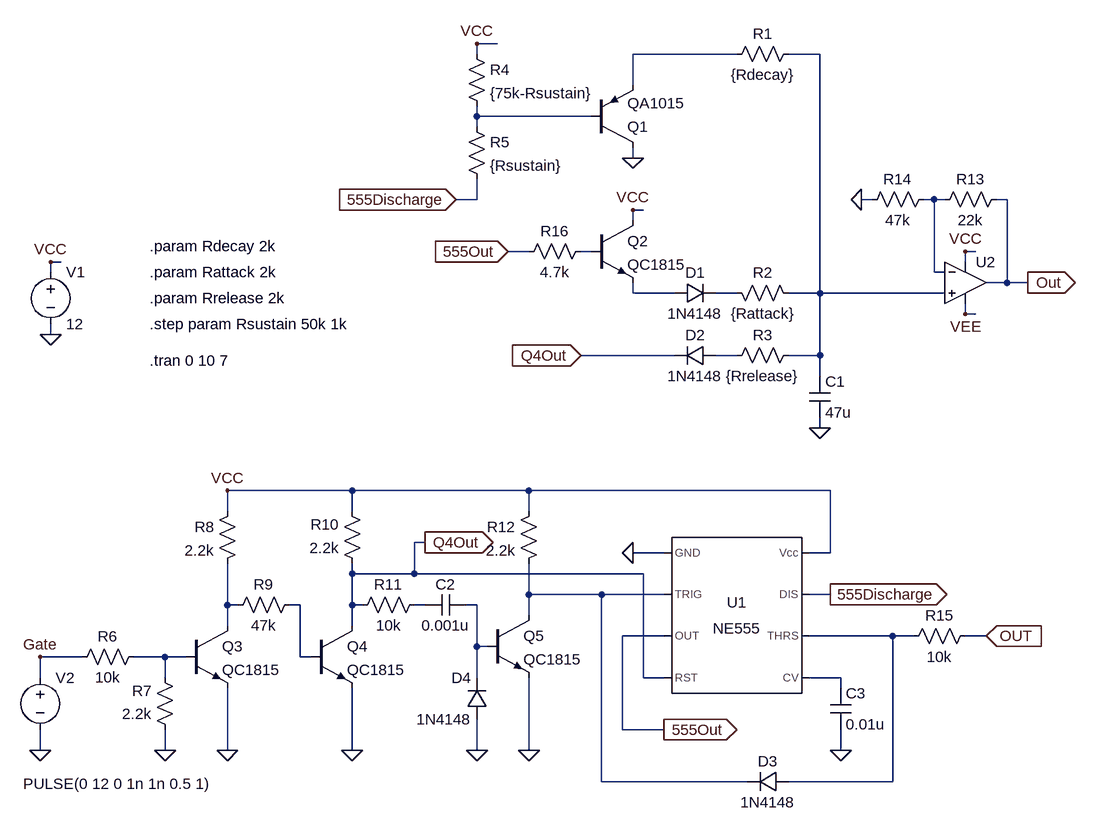
[diagram p0: schematic EG_Analog2_0.asc]
EG_Analog2_0.asc, the LTspice schematic file:
Version 4
SHEET 1 1740 1424
WIRE 704 240 672 240
WIRE 672 256 672 240
WIRE 1072 256 912 256
WIRE 1200 256 1152 256
WIRE 912 304 912 256
WIRE 672 352 672 336
WIRE 848 352 672 352
WIRE 672 368 672 352
WIRE 912 416 912 400
WIRE 672 480 672 448
WIRE 672 480 640 480
WIRE 1280 480 1264 480
WIRE 1376 480 1360 480
WIRE 1392 480 1376 480
WIRE 1488 480 1472 480
WIRE 928 496 912 496
WIRE 912 512 912 496
WIRE 752 560 720 560
WIRE 848 560 832 560
WIRE 1440 560 1424 560
WIRE 32 576 16 576
WIRE 1424 576 1424 560
WIRE 16 592 16 576
WIRE 1376 592 1376 480
WIRE 1392 592 1376 592
WIRE 1488 608 1488 480
WIRE 1488 608 1456 608
WIRE 1520 608 1488 608
WIRE 912 624 912 608
WIRE 976 624 912 624
WIRE 1072 624 1040 624
WIRE 1200 624 1200 256
WIRE 1200 624 1152 624
WIRE 1392 624 1200 624
WIRE 1424 656 1424 640
WIRE 1440 656 1424 656
WIRE 16 688 16 672
WIRE 976 720 832 720
WIRE 1072 720 1040 720
WIRE 1200 720 1200 624
WIRE 1200 720 1152 720
WIRE 1200 752 1200 720
WIRE 1200 832 1200 816
WIRE 480 928 288 928
WIRE 752 928 480 928
WIRE 1216 928 752 928
WIRE 288 960 288 928
WIRE 480 960 480 928
WIRE 752 960 752 928
WIRE 592 1008 576 1008
WIRE 960 1024 912 1024
WIRE 1216 1024 1216 928
WIRE 1216 1024 1184 1024
WIRE 480 1056 480 1040
WIRE 576 1056 576 1008
WIRE 576 1056 480 1056
WIRE 928 1056 576 1056
WIRE 752 1088 752 1040
WIRE 864 1088 752 1088
WIRE 960 1088 864 1088
WIRE 1216 1088 1184 1088
WIRE 288 1104 288 1040
WIRE 304 1104 288 1104
WIRE 400 1104 384 1104
WIRE 480 1104 480 1056
WIRE 496 1104 480 1104
WIRE 592 1104 576 1104
WIRE 672 1104 656 1104
WIRE 752 1120 752 1088
WIRE 288 1136 288 1104
WIRE 480 1136 480 1104
WIRE 960 1152 896 1152
WIRE 1312 1152 1184 1152
WIRE 1344 1152 1312 1152
WIRE 1456 1152 1424 1152
WIRE 672 1168 672 1104
WIRE 688 1168 672 1168
WIRE 64 1184 0 1184
WIRE 192 1184 144 1184
WIRE 224 1184 192 1184
WIRE 400 1184 400 1104
WIRE 416 1184 400 1184
WIRE 0 1216 0 1184
WIRE 192 1216 192 1184
WIRE 672 1216 672 1168
WIRE 928 1216 928 1056
WIRE 960 1216 928 1216
WIRE 1232 1216 1184 1216
WIRE 1232 1232 1232 1216
WIRE 896 1296 896 1152
WIRE 960 1296 896 1296
WIRE 0 1328 0 1296
WIRE 192 1328 192 1296
WIRE 288 1328 288 1232
WIRE 480 1328 480 1232
WIRE 672 1328 672 1280
WIRE 752 1328 752 1216
WIRE 1232 1328 1232 1296
WIRE 864 1376 864 1088
WIRE 1088 1376 864 1376
WIRE 1312 1376 1312 1152
WIRE 1312 1376 1152 1376
FLAG 640 480 555Discharge
IOPIN 640 480 In
FLAG 912 416 0
FLAG 720 560 555Out
IOPIN 720 560 In
FLAG 832 720 Q4Out
IOPIN 832 720 In
FLAG 1200 832 0
FLAG 912 496 VCC
FLAG 1520 608 Out
IOPIN 1520 608 Out
FLAG 16 688 0
FLAG 16 576 VCC
FLAG 672 240 VCC
FLAG 0 1328 0
FLAG 192 1328 0
FLAG 288 1328 0
FLAG 480 1328 0
FLAG 752 1328 0
FLAG 592 1008 Q4Out
IOPIN 592 1008 Out
FLAG 912 1024 0
FLAG 960 1296 555Out
IOPIN 960 1296 Out
FLAG 1216 1088 555Discharge
IOPIN 1216 1088 Out
FLAG 1456 1152 OUT
IOPIN 1456 1152 In
FLAG 1232 1328 0
FLAG 288 928 VCC
FLAG 0 1184 Gate
FLAG 1264 480 0
FLAG 1424 560 VCC
FLAG 1424 656 VEE
FLAG 672 1328 0
SYMBOL pnp 848 400 M180
SYMATTR InstName Q1
SYMATTR Value QA1015
SYMBOL res 1168 240 R90
WINDOW 0 0 56 VBottom 2
WINDOW 3 32 56 VTop 2
SYMATTR InstName R1
SYMATTR Value {Rdecay}
SYMBOL npn 848 512 R0
SYMATTR InstName Q2
SYMATTR Value QC1815
SYMBOL diode 976 640 R270
WINDOW 0 32 32 VTop 2
WINDOW 3 0 32 VBottom 2
SYMATTR InstName D1
SYMATTR Value 1N4148
SYMBOL res 1056 608 M90
WINDOW 0 0 56 VBottom 2
WINDOW 3 32 56 VTop 2
SYMATTR InstName R2
SYMATTR Value {Rattack}
SYMBOL diode 1040 704 R90
WINDOW 0 0 32 VBottom 2
WINDOW 3 32 32 VTop 2
SYMATTR InstName D2
SYMATTR Value 1N4148
SYMBOL res 1168 704 R90
WINDOW 0 0 56 VBottom 2
WINDOW 3 32 56 VTop 2
SYMATTR InstName R3
SYMATTR Value {Rrelease}
SYMBOL cap 1184 752 R0
SYMATTR InstName C1
SYMATTR Value 47u
SYMBOL voltage 16 576 R0
WINDOW 123 0 0 Left 2
WINDOW 39 0 0 Left 2
SYMATTR InstName V1
SYMATTR Value 12
SYMBOL res 656 240 R0
SYMATTR InstName R4
SYMATTR Value {75k-Rsustain}
SYMBOL res 656 352 R0
SYMATTR InstName R5
SYMATTR Value {Rsustain}
SYMBOL voltage 0 1200 R0
WINDOW 3 -26 179 Left 2
WINDOW 123 0 0 Left 2
WINDOW 39 0 0 Left 2
SYMATTR Value PULSE(0 12 0 1n 1n 0.5 1)
SYMATTR InstName V2
SYMBOL res 160 1168 R90
WINDOW 0 0 56 VBottom 2
WINDOW 3 32 56 VTop 2
SYMATTR InstName R6
SYMATTR Value 10k
SYMBOL res 208 1312 R180
WINDOW 0 36 76 Left 2
WINDOW 3 36 40 Left 2
SYMATTR InstName R7
SYMATTR Value 2.2k
SYMBOL npn 224 1136 R0
SYMATTR InstName Q3
SYMATTR Value QC1815
SYMBOL res 304 944 M0
SYMATTR InstName R8
SYMATTR Value 2.2k
SYMBOL res 400 1088 R90
WINDOW 0 0 56 VBottom 2
WINDOW 3 32 56 VTop 2
SYMATTR InstName R9
SYMATTR Value 47k
SYMBOL npn 416 1136 R0
SYMATTR InstName Q4
SYMATTR Value QC1815
SYMBOL cap 656 1088 R90
WINDOW 0 0 32 VBottom 2
WINDOW 3 32 32 VTop 2
SYMATTR InstName C2
SYMATTR Value 0.001u
SYMBOL npn 688 1120 R0
SYMATTR InstName Q5
SYMATTR Value QC1815
SYMBOL res 496 1056 R180
WINDOW 0 36 76 Left 2
WINDOW 3 36 40 Left 2
SYMATTR InstName R10
SYMATTR Value 2.2k
SYMBOL res 592 1088 R90
WINDOW 0 0 56 VBottom 2
WINDOW 3 32 56 VTop 2
SYMATTR InstName R11
SYMATTR Value 10k
SYMBOL res 768 944 M0
SYMATTR InstName R12
SYMATTR Value 2.2k
SYMBOL Misc\\NE555 1072 1120 R0
SYMATTR InstName U1
SYMBOL cap 1216 1232 R0
SYMATTR InstName C3
SYMATTR Value 0.01u
SYMBOL diode 1152 1360 R90
WINDOW 0 0 32 VBottom 2
WINDOW 3 32 32 VTop 2
SYMATTR InstName D3
SYMATTR Value 1N4148
SYMBOL Opamps\\UniversalOpamp2 1424 608 R0
SYMATTR InstName U2
SYMBOL res 1488 464 R90
WINDOW 0 0 56 VBottom 2
WINDOW 3 32 56 VTop 2
SYMATTR InstName R13
SYMATTR Value 22k
SYMBOL res 1376 464 R90
WINDOW 0 0 56 VBottom 2
WINDOW 3 32 56 VTop 2
SYMATTR InstName R14
SYMATTR Value 47k
SYMBOL res 1440 1136 R90
WINDOW 0 0 56 VBottom 2
WINDOW 3 32 56 VTop 2
SYMATTR InstName R15
SYMATTR Value 10k
SYMBOL res 848 544 R90
WINDOW 0 0 56 VBottom 2
WINDOW 3 32 56 VTop 2
SYMATTR InstName R16
SYMATTR Value 4.7k
SYMBOL diode 688 1280 R180
WINDOW 0 24 64 Left 2
WINDOW 3 24 0 Left 2
SYMATTR InstName D4
SYMATTR Value 1N4148
TEXT 168 552 Left 2 !.param Rdecay 2k
TEXT 168 592 Left 2 !.param Rattack 2k
TEXT 168 632 Left 2 !.param Rrelease 2k
TEXT 168 728 Left 2 !.tran 0 10 7
TEXT 168 672 Left 2 !.step param Rsustain 50k 1k

The netlist it stands for:
* EG_Analog2_0.asc
Q1 0 N003 N001 0 QA1015
R1 N002 N001 {Rdecay}
Q2 VCC N005 N006 0 QC1815
D1 N006 N007 1N4148
R2 N007 N002 {Rattack}
D2 N008 Q4Out 1N4148
R3 N002 N008 {Rrelease}
C1 N002 0 47u
V1 VCC 0 12
R4 VCC N003 {75k-Rsustain}
R5 N003 555Discharge {Rsustain}
V2 Gate 0 PULSE(0 12 0 1n 1n 0.5 1)
R6 N015 Gate 10k
R7 0 N015 2.2k
Q3 N010 N015 0 0 QC1815
R8 VCC N010 2.2k
R9 N011 N010 47k
Q4 Q4Out N011 0 0 QC1815
C2 N013 N012 0.001u
Q5 N009 N013 0 0 QC1815
R10 Q4Out VCC 2.2k
R11 N012 Q4Out 10k
R12 VCC N009 2.2k
XU1 0 N009 555Out Q4Out N016 N014 555Discharge VCC NE555  ; pins GND TRIG OUT RST CV THRS DIS Vcc
C3 N016 0 0.01u
D3 N014 N009 1N4148
XU2 N002 N004 VCC VEE Out level.2 Avol=1Meg GBW=10Meg Slew=10Meg ilimit=25m rail=0 Vos=0 phimargin=45 en=0 enk=0 in=0 ink=0 Rin=500Meg  ; pins IN+ IN- V+ V- OUT
R13 Out N004 22k
R14 N004 0 47k
R15 Out N014 10k
R16 N005 555Out 4.7k
D4 0 N013 1N4148
.model D D
.lib standard.dio
.model NPN NPN
.model PNP PNP
.lib standard.bjt
.param Rdecay 2k
.param Rattack 2k
.param Rrelease 2k
.tran 0 10 7
.step param Rsustain 50k 1k
.lib NE555.sub
.lib UniversalOpamps2.sub
.backanno
.end